# EAGLE design 5mm_front_end (EAGLE 8.7.0)
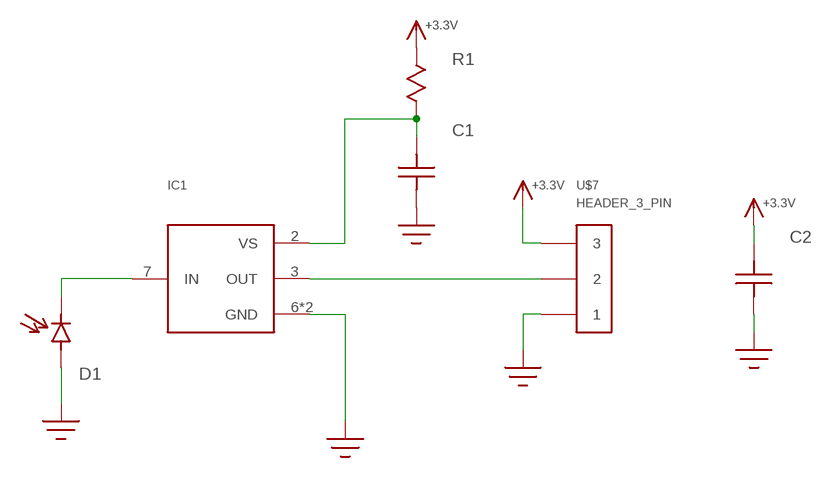
[diagram p0: schematic, sheet 1]

## Parts
C1  C0603  [C0603]
C2  C0805  [0805]
D1  PHOTODIODE  [LED_RA_5MM]
IC1  VSOP98260  [VSOP98260]
R1  R0603  [R0603]
U$7  HEADER_3_PIN  [HEADER_3_PIN]

## Nets
+3.3V: C2.P$2 R1.P$1 U$7.3
GND: C1.P$1 C2.P$1 D1.A IC1.6(GND) IC1.8(GND) U$7.1
N$1: C1.P$2 IC1.2(VS) R1.P$2
N$4: D1.C IC1.7(IN)
N$5: IC1.3(OUT) U$7.2

## Library data of the parts
C1 C2 = ssir:C
D1 = ssir:PHOTODIODE
IC1 = ssir:VSOP98260
R1 = ssir:R
U$7 = ssir:HEADER_3_PIN

## Board
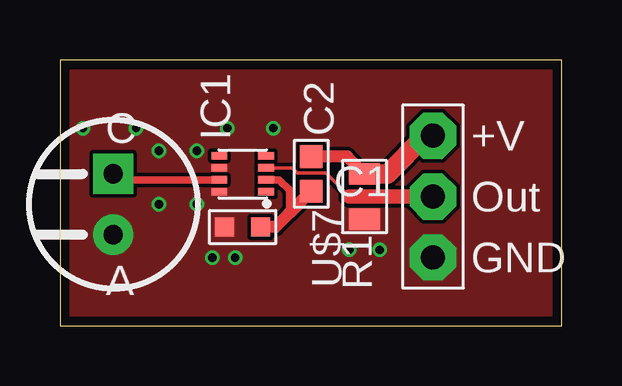
[diagram p1: board, top side]
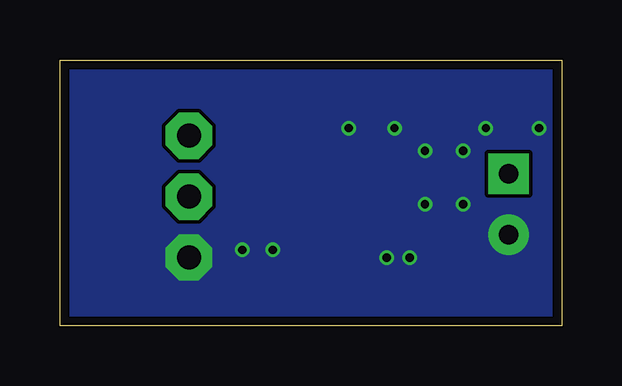
[diagram p2: board, bottom side, seen from below]

Size 20.93 x 11.1 mm. Coordinates in mm from the lower left corner, seen from the top.
Outline: 0,0 20.93,0 20.93,11.1 0,11.1 0,0
Copper layers (1*16): Top 0.035559375mm / dielectric 1.6mm / Bottom 0.035559375mm
Design rules "oshpark-2layer": minimum track width 6mil, minimum drill 10mil, track to track 6mil, track to pad 6mil, pad to pad 6mil, via to via 6mil, smd to smd 6mil, copper to edge 15mil, drill to drill 6mil, minimum pad ring 5mil, minimum via ring 5mil, stop-mask expansion 2.5mil, vias tented up to drill 0mil, thermal gap 10mil

### Footprints (pad centres in the part's own frame; a part is rotated, then mirrored left to right if it is on the bottom)
C0603 = smd 0.8 x 0.8: P$1 -0.75,0; P$2 0.75,0
0805 = smd 0.9 x 1.3: P$1 -0.95,0; P$2 0.95,0
LED_RA_5MM = drill 0.8 pad 1.676: A -1.27,0 | drill 0.8 pad 1.676 square: C 1.27,0
VSOP98260 = smd 0.33 x 0.65: 1 -0.75,-0.975; 2 -0.25,-0.975; 3 0.25,-0.975; 4 0.75,-0.975; 5 0.75,0.975; 6 0.25,0.975; 7 -0.25,0.975; 8 -0.75,0.975
R0603 = smd 0.95 x 0.95: P$1 -0.725,0; P$2 0.725,0
HEADER_3_PIN = drill 1 pad 1.93 octagon: 1 -2.54,0; 2 0,0; 3 2.54,0

### Placement (x,y rotation side)
C1  7.62,4.13 0 top
C2  12.7,5.4 90 top
D1  2.22,5.08 90 top
IC1  7.62,6.35 90 top
R1  10.48,6.35 270 top
U$7  15.56,5.4 90 top

### Tracks (layer width: path | path; a pad name or v marks a point on that pad's centre or on a via)
+3.3V
  Top 0.508: C2.P$2 11.97,7.08 R1.P$1
  Top 0.813: U$7.3 15.24,7.94 13.65,6.35 C2.P$2
GND  (via drill 0.35)
  other vias: 0.95,8.26 3.17,8.26 6.35,2.86 7.3,2.86 6.99,8.26 8.89,8.26 12.06,3.17 13.34,3.17 4.13,7.3 4.13,5.08 5.71,5.08 5.71,7.3
  pour Top (no thermals): 0,0 20.95,0 20.95,11.11 0,11.11
  pour Bottom (no thermals): 0,0 20.95,0 20.95,11.11 0,11.11
N$1
  Top 0.305: IC1.2 9.14,6.1 9.57,5.67 9.57,4.72
  Top 0.508: R1.P$2 9.57,4.72 8.98,4.13 C1.P$2
N$4
  Top 0.305: IC1.7 2.47,6.1 D1.C
N$5
  Top 0.152: IC1.3 9.68,6.6 9.91,6.37 11.09,6.37 12.06,5.4
  Top 0.61: 12.06,5.4 U$7.2

### Text on the board
tPlace: C | +V | Out | GND | A